# Altium schematic sheet 06_RTL8711.SchDoc
size A4
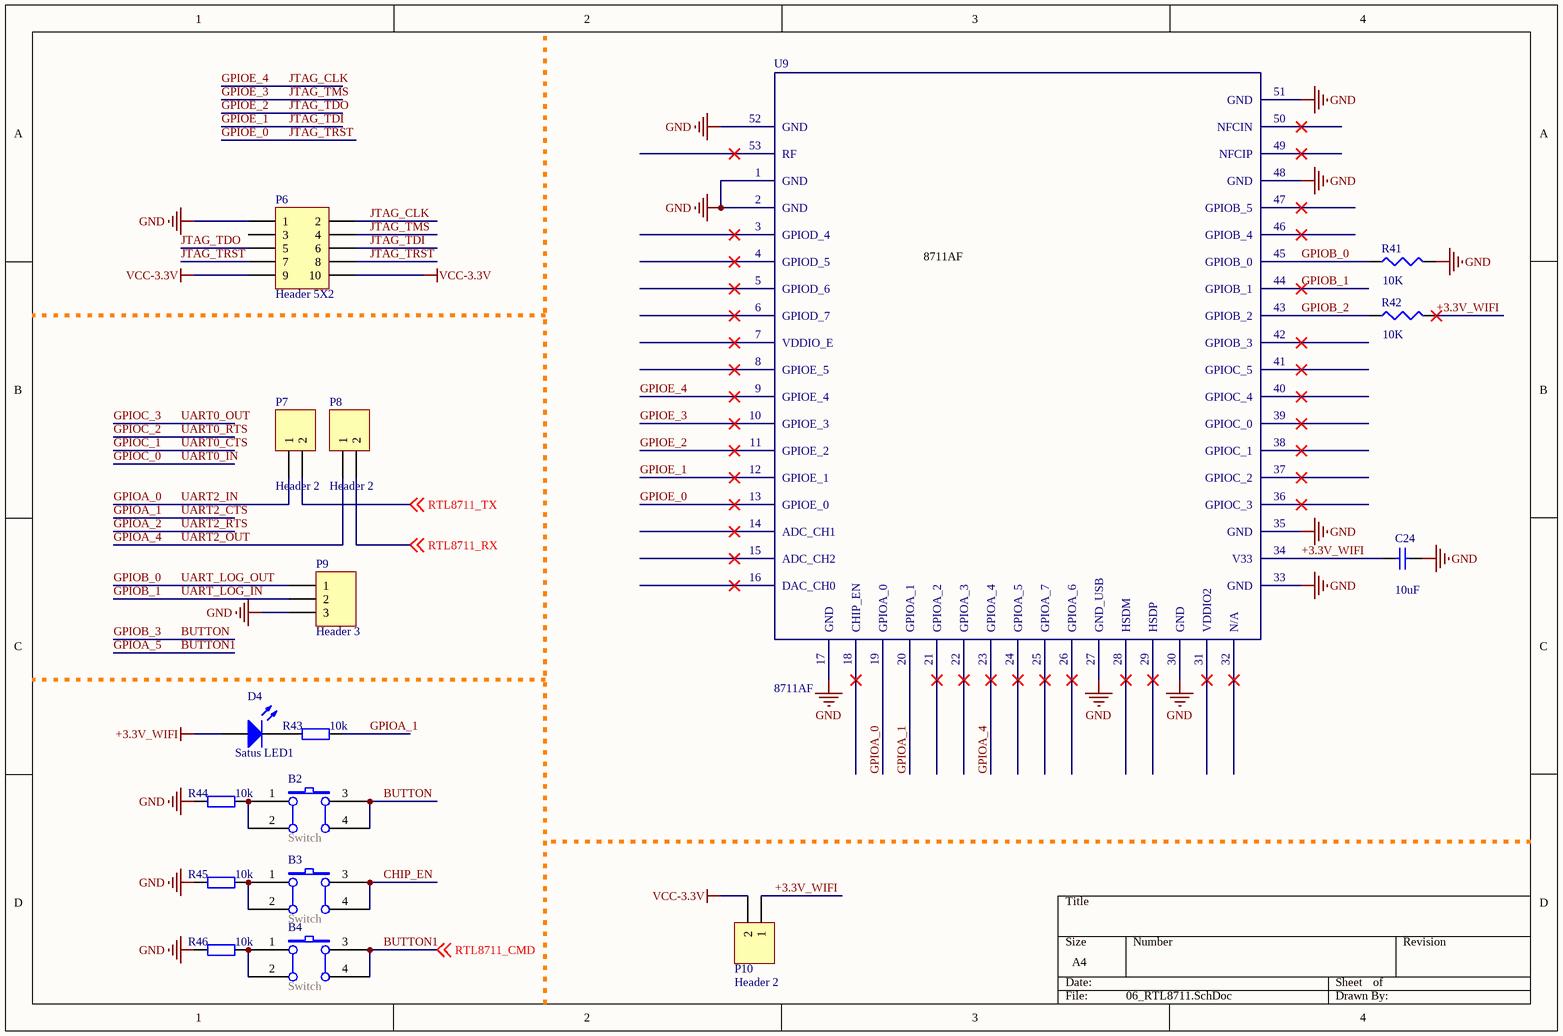
[diagram p0: 06_RTL8711.SchDoc]

## Parts
B2  Switch  [SWITCH-0.65/0.45]
B3  Switch  [SWITCH-0.65/0.45]
B4  Switch  [SWITCH-0.65/0.45]
C24  value 10uF  [RB2.5-6.3]
D4  Satus LED1  [LED-R3.0]
P6  Header 5X2  [HDR2X5]
P7  Header 2  [HDR1X2]
P8  Header 2  [HDR1X2]
P9  Header 3  [HDR1X3]
P10  Header 2  [HDR1X2]
R41  value 10K  [AXIAL-0.3]
R42  value 10K  [AXIAL-0.3]
R43  10k  [AXIAL-0.3]
R44  10k  [AXIAL-0.3]
R45  10k  [AXIAL-0.3]
R46  10k  [AXIAL-0.3]
U9  8711AF  [53PIN-MODULE-PLATFORM -2]

## Nets
+3.3V_WIFI: C24.1 D4.1(A) P10.1 R42.2 U9.34(V33)
GND: C24.2 P6.1 P9.3 R41.2 R44.1 R45.1 R46.1 U9.1(GND) U9.2(GND) U9.17(GND) U9.27(GND_USB) U9.30(GND) U9.33(GND) U9.35(GND) U9.48(GND) U9.51(GND) U9.52(GND)
VCC-3.3V: P6.9 P6.10 P10.2
BUTTON: B2.3(B1) B2.4(A1)  [also labelled GPIOB_3]
BUTTON1: B4.3(B1) B4.4(A1) ; off-sheet RTL8711_CMD  [also labelled GPIOA_5, RTL8711_CMD]
CHIP_EN: B3.3(B1) B3.4(A1)
GPIOA_0: P7.1 U9.19(GPIOA_0)  [also labelled UART2_IN]
GPIOA_1: R43.2 U9.20(GPIOA_1)  [also labelled UART2_CTS]
GPIOA_4: P8.1 U9.23(GPIOA_4)  [also labelled UART2_OUT]
GPIOB_0: P9.1 R41.1 U9.45(GPIOB_0)  [also labelled UART_LOG_OUT]
GPIOB_1: P9.2 U9.44(GPIOB_1)  [also labelled UART_LOG_IN]
GPIOB_2: R42.1 U9.43(GPIOB_2)
GPIOE_0: P6.7 P6.8 U9.13(GPIOE_0)  [also labelled JTAG_TRST]
GPIOE_1: P6.6 U9.12(GPIOE_1)  [also labelled JTAG_TDI]
GPIOE_2: P6.5 U9.11(GPIOE_2)  [also labelled JTAG_TDO]
GPIOE_3: P6.4 U9.10(GPIOE_3)  [also labelled JTAG_TMS]
GPIOE_4: P6.2 U9.9(GPIOE_4)  [also labelled JTAG_CLK]
RTL8711_RX: P8.2 ; off-sheet RTL8711_RX
RTL8711_TX: P7.2 ; off-sheet RTL8711_TX
NetB2_1: B2.1(A0) B2.2(B0) R44.2
NetB3_1: B3.1(A0) B3.2(B0) R45.2
NetB4_1: B4.1(A0) B4.2(B0) R46.2
NetD4_2: D4.2(K) R43.1

Not connected (* = marked no-connect by the designer): P6 3; U9 3(GPIOD_4)* 4(GPIOD_5)* 5(GPIOD_6)* 6(GPIOD_7)* 7(VDDIO_E)* 8(GPIOE_5)* 14(ADC_CH1)* 15(ADC_CH2)* 16(DAC_CH0)* 18(CHIP_EN)* 21(GPIOA_2)* 22(GPIOA_3)* 24(GPIOA_5)* 25(GPIOA_7)* 26(GPIOA_6)* 28(HSDM)* 29(HSDP)* 31(VDDIO2)* 32(N/A)* 36(GPIOC_3)* 37(GPIOC_2)* 38(GPIOC_1)* 39(GPIOC_0)* 40(GPIOC_4)* 41(GPIOC_5)* 42(GPIOB_3)* 46(GPIOB_4)* 47(GPIOB_5)* 49(NFCIP)* 50(NFCIN)* 53(RF)*

## Library data of the parts
B2-B4 = Switch: Tactile Switch
C24 = Cap Semi: Capacitor (Semiconductor SIM Model); Published: 8-Jun-2000; LatestRevisionDate: 17-Jul-2002; LatestRevisionNote: Re-released for DXP Platform.; PackageReference: C1206; Publisher: Altium Limited
D4 = LED1: Typical RED GaAs LED; Published: 8-Jun-2000; LatestRevisionDate: 08-Jul-2005; LatestRevisionNote: Mech Layer 1 removed.; PackageReference: LED-1; Publisher: Altium Limited; PackageDescription: LED; 2 Leads
P6 = Header 5X2: Header, 5-Pin, Dual row; LatestRevisionDate: 17-Jul-2002; LatestRevisionNote: Re-released for DXP Platform.; Publisher: Altium Limited
P7 P8 P10 = Header 2: Header, 2-Pin; LatestRevisionDate: 17-Jul-2002; LatestRevisionNote: Re-released for DXP Platform.; Publisher: Altium Limited
P9 = Header 3: Header, 3-Pin; LatestRevisionDate: 17-Jul-2002; LatestRevisionNote: Re-released for DXP Platform.; Publisher: Altium Limited
R41 R42 = Res3: Resistor; Published: 8-Jun-2000; LatestRevisionDate: 04-Mar-2005; LatestRevisionNote: PCB Footprint replaced.; PackageReference: J1-0603; Publisher: Altium Limited
R43-R46 = Res1: 贴片电阻; Published: 8-Jun-2000; LatestRevisionDate: 17-Jul-2002; LatestRevisionNote: Re-released for DXP Platform.; PackageReference: AXIAL-0.4; Publisher: Altium Limited; Value: 10k